# EAGLE design fpga (EAGLE 5.11)
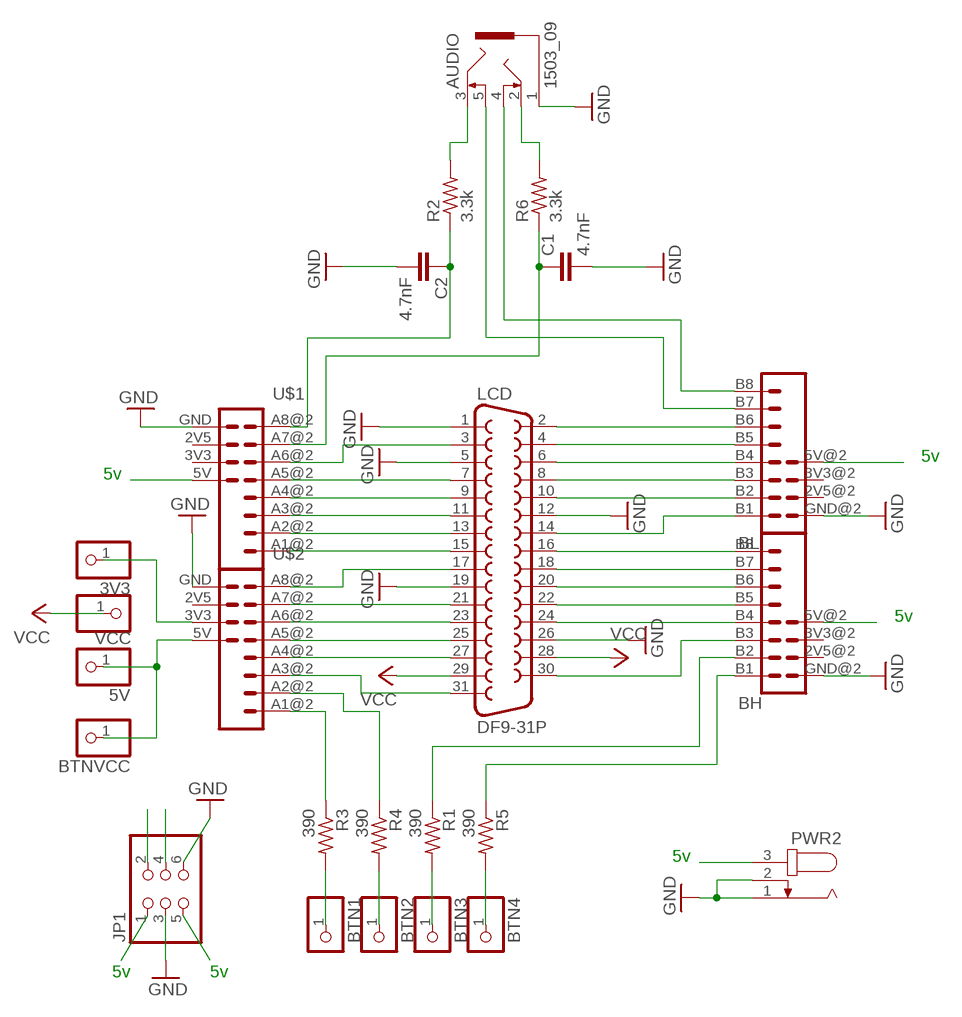
[diagram p0: schematic, sheet 1]

## Parts
3V3  PINHD-1X1  [1X01]
5V  PINHD-1X1  [1X01]
AUDIO  1503_09  [1503_09]
BH  WING_8BIT  [WINGSIDE_8BIT]
BL  WING_8BIT  [WINGSIDE_8BIT]
BTN1  PINHD-1X1  [1X01]
BTN2  PINHD-1X1  [1X01]
BTN3  PINHD-1X1  [1X01]
BTN4  PINHD-1X1  [1X01]
BTNVCC  PINHD-1X1  [1X01]
C1  4.7nF  C-EU025-040X050  [C025-040X050]
C2  4.7nF  C-EU025-040X050  [C025-040X050]
JP1  PINHD-2X3  [2X03]
LCD  DF9-31P  [DF9-31P]
PWR2  JACK-PLUG  [SPC4078-NOSLOT]
R1  390  R-US_0204/7  [0204/7]
R2  3.3k  R-US_0204/7  [0204/7]
R3  390  R-US_0204/7  [0204/7]
R4  390  R-US_0204/7  [0204/7]
R5  390  R-US_0204/7  [0204/7]
R6  3.3k  R-US_0204/7  [0204/7]
U$1  WING_8BIT2  [COCOON_48BIT]
U$2  WING_8BIT2  [COCOON_48BIT]
VCC  PINHD-1X1  [1X01]

## Nets
5V: 5V.1 BH.5V@2(5V) BL.5V@2(5V) BTNVCC.1 JP1.1 JP1.5 PWR2.3 U$1.5V(A4) U$2.5V(A4)
GND: AUDIO.1 BH.GND@2(GND) BL.GND@2(GND) C1.2 C2.2 JP1.3 JP1.6 LCD.1 LCD.5 LCD.12 LCD.19 LCD.26 PWR2.1 PWR2.2 U$1.GND(A1) U$2.GND(A1)
N$1: AUDIO.4 BL.B8
N$2: C1.1 R6.1 U$1.A7@2(A15)
N$3: AUDIO.3 R2.2
N$4: AUDIO.2 R6.2
N$5: AUDIO.5 BL.B7
N$6: BH.B1 R5.1
N$7: LCD.31 U$2.A3@2(A11)
N$8: LCD.27 U$2.A4@2(A12)
N$9: LCD.25 U$2.A5@2(A13)
N$10: LCD.23 U$2.A6@2(A14)
N$11: LCD.21 U$2.A7@2(A15)
N$12: BH.B2 R1.1
N$13: BH.B3 LCD.30
N$14: LCD.17 U$2.A8@2(A16)
N$15: LCD.15 U$1.A1@2(A9)
N$16: LCD.13 U$1.A2@2(A10)
N$17: LCD.11 U$1.A3@2(A11)
N$18: LCD.9 U$1.A4@2(A12)
N$19: BH.B4 LCD.24
N$20: BH.B5 LCD.22
N$21: BH.B6 LCD.20
N$22: BH.B7 LCD.18
N$23: BH.B8 LCD.16
N$24: BL.B1 LCD.14
N$25: BL.B3 LCD.8
N$26: BL.B4 LCD.6
N$27: BL.B2 LCD.10
N$28: BL.B5 LCD.4
N$29: BL.B6 LCD.2
N$30: JP1.4
N$31: JP1.2
N$33: LCD.7 U$1.A5@2(A13)
N$34: R4.1 U$2.A2@2(A10)
N$35: BTN4.1 R5.2
N$36: BTN3.1 R1.2
N$37: BTN1.1 R3.2
N$38: BTN2.1 R4.2
N$39: LCD.3 U$1.A6@2(A14)
N$40: R3.1 U$2.A1@2(A9)
N$41: C2.1 R2.1 U$1.A8@2(A16)
N$42: 3V3.1 U$2.3V3(A3)
VCC: LCD.28 LCD.29 VCC.1
Unconnected: BH.2V5@2(2V5) BH.3V3@2(3V3) BL.2V5@2(2V5) BL.3V3@2(3V3) U$1.2V5(A2) U$1.3V3(A3) U$2.2V5(A2)

## Notes on the sheet
- 5v
- 5v
- 5v
- 5v
- 5v | 5v

## Library data of the parts
3V3 5V BTN1-BTN4 BTNVCC VCC = pinhead:PINHD-1X1: PIN HEADER
AUDIO = con-lumberg:1503_09: Jack connectors according to JISC 6560, 3.5 mm Klinkeneinbaukupplung nach JISC 6560, 3,5 mm, 3-polig/ stereo, abgewinkelte Ausführung, mit 2 Öffnern und Lötaugen, für Leiterplatten Rückseitenmontage Source: http://www.lumberg.com/Produkte/PDFs/1503_09.pdf
BH BL = GadgetFactory_Pub:WING_8BIT
C1 C2 = resistor:C-EU: CAPACITOR, European symbol
JP1 = pinhead:PINHD-2X3: PIN HEADER
LCD = con-hirose:DF9-31P
PWR2 = GadgetFactory:JACK-PLUG: DC POWER JACK Power Jack, DC, Right Angle, Through Hole, Rated 5A at 16VDC, PC Terminals Distributor: Farnell (www.Farnell.de) Drawing: 84N1161.pdf / 84N1162.pdf Manufacturer: SPC Technology (www.spctechnology.com) Type: SPC4077 / SPC 4078
R1-R6 = rcl:R-US_: RESISTOR, American symbol
U$1 U$2 = GadgetFactory_Pub:WING_8BIT2

## Board
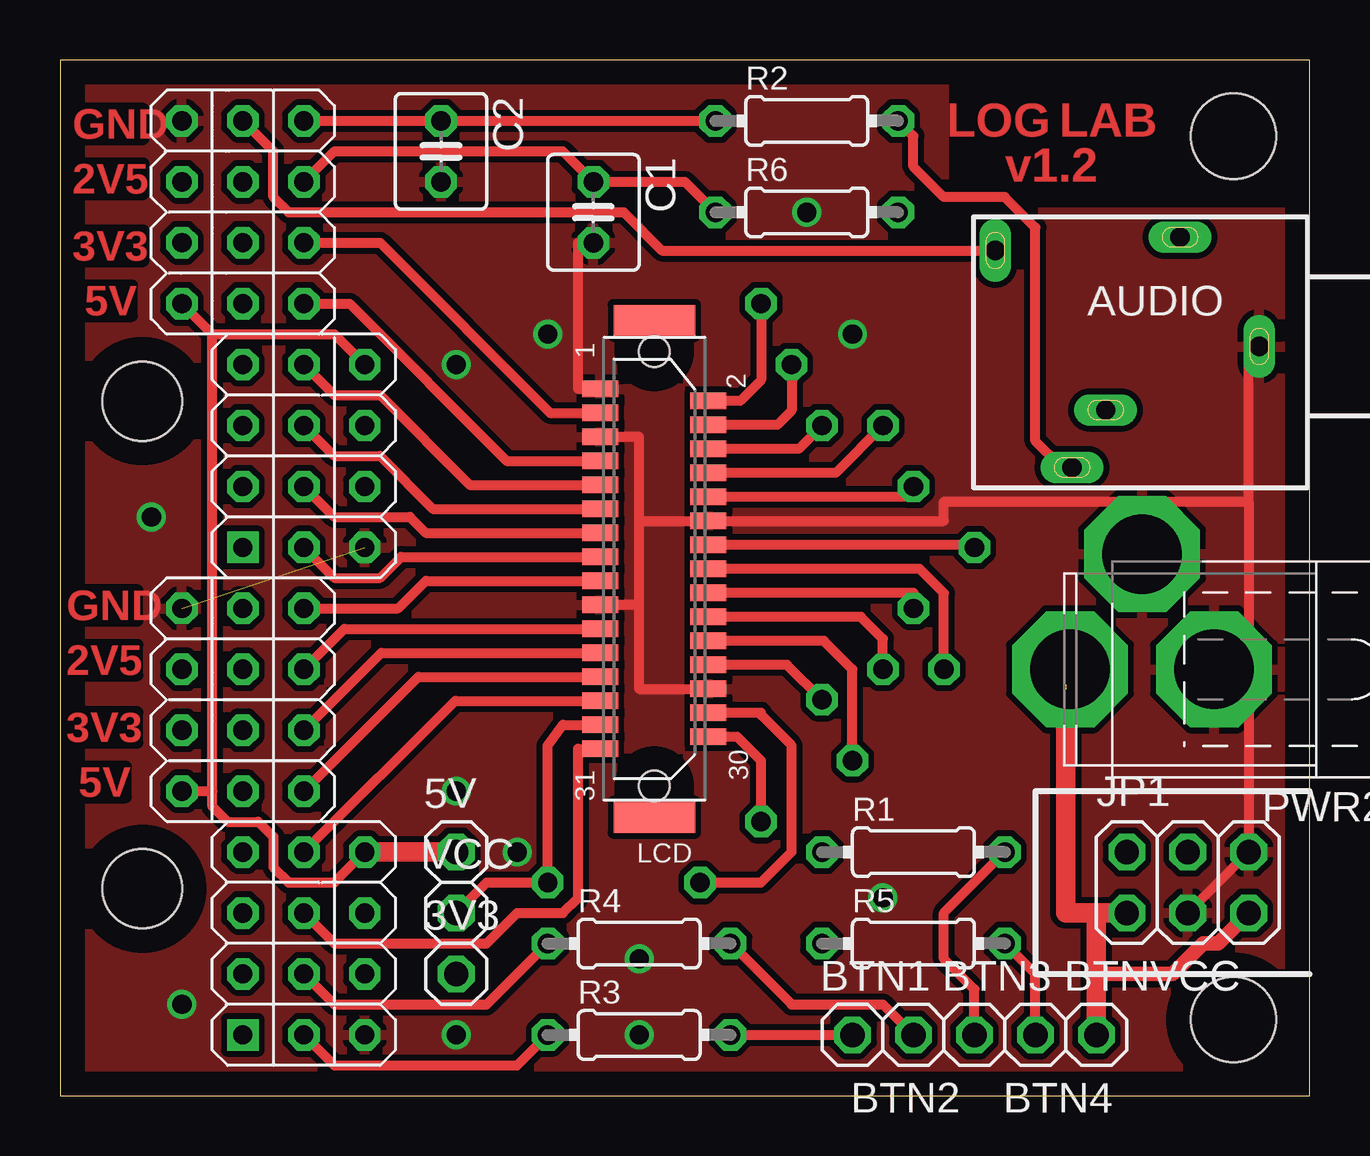
[diagram p1: board, top side]
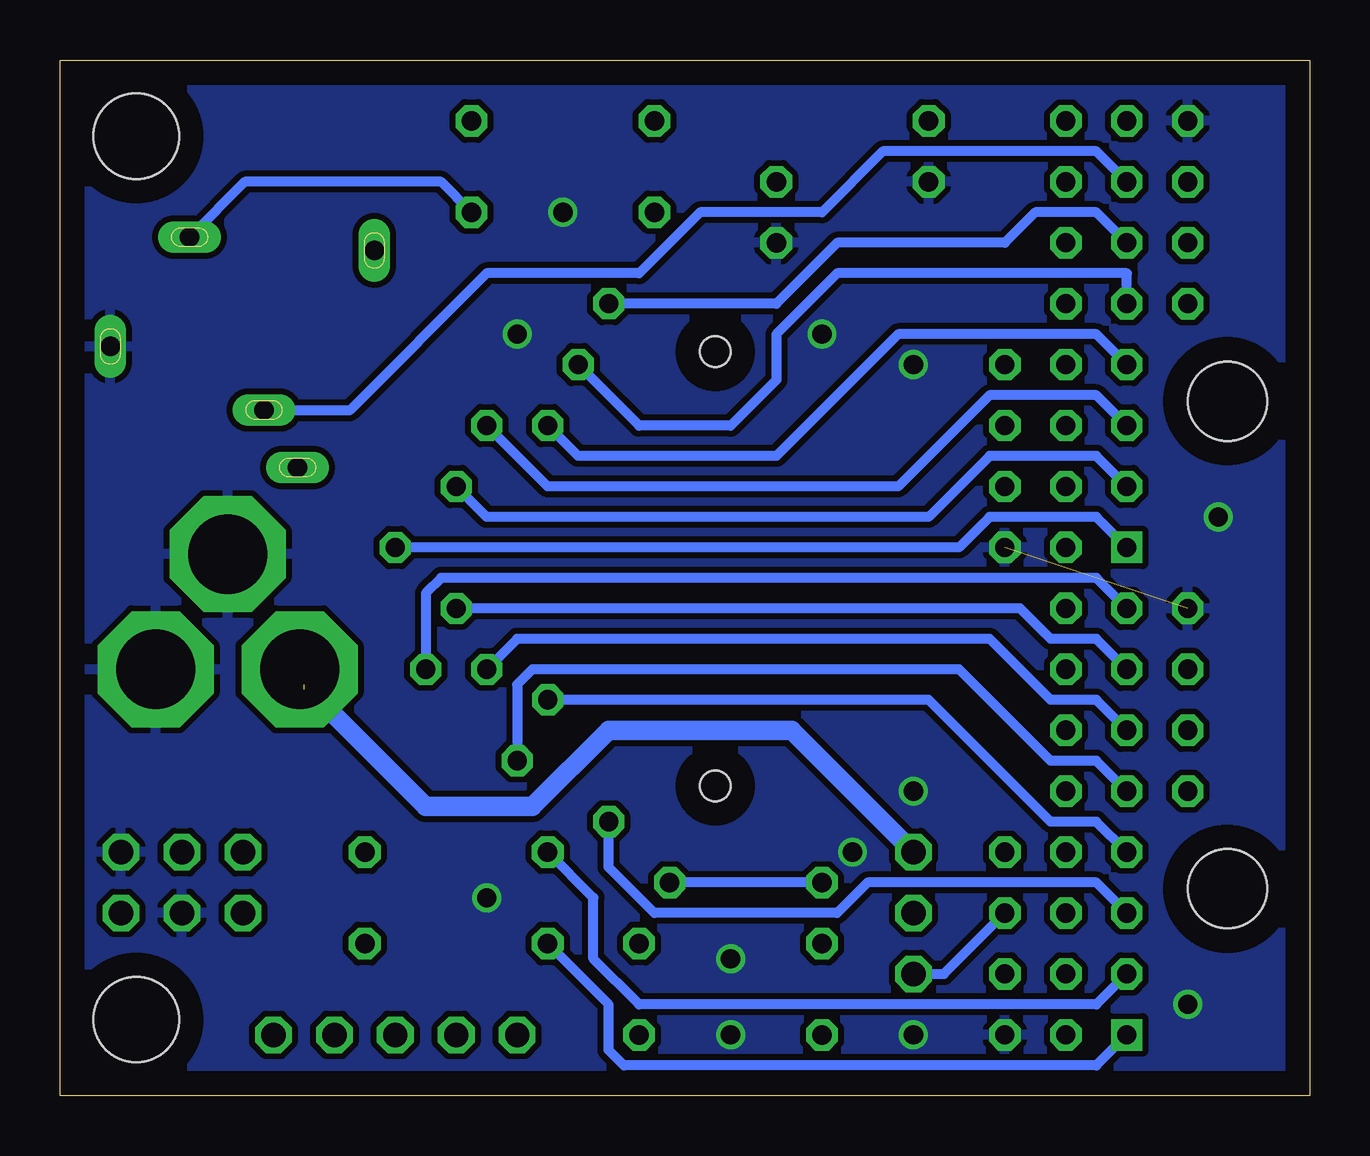
[diagram p2: board, bottom side, seen from below]

Size 52.07 x 43.18 mm. Coordinates in mm from the lower left corner, seen from the top.
Outline: 0,0 52.07,0 52.07,43.18 0,43.17 0,0
Copper layers (1*16): Top 0.035mm / dielectric 1.5mm / Bottom 0.035mm
Design rules "10mils": minimum track width 10mil, minimum drill 24mil, track to track 10mil, track to pad 10mil, pad to pad 10mil, via to via 10mil, smd to smd 10mil, copper to edge 40mil, drill to drill 10mil, minimum pad ring 10mil, minimum via ring 8mil, stop-mask expansion 0mil, vias tented up to drill 0mil, thermal gap 10mil
Holes 3.56 mm at 48.9,3.18 48.9,40.01

### Footprints (pad centres in the part's own frame; a part is rotated, then mirrored left to right if it is on the bottom)
1X01 = drill 1.016 octagon: 1 0,0
1503_09 = drill 0.8 pad 1.2 long: 1 0,-2.1; 2 -4.55,-5.4; 3 5.05,-9.9; 4 -4,-13.1; 5 2.65,-8.5
WINGSIDE_8BIT = drill 0.8 octagon: 2V5@2 16.51,3.81; 3V3@2 13.97,3.81; 5V@2 11.43,3.81; B2 3.81,1.27; B3 6.35,1.27; B4 8.89,1.27; B5 11.43,1.27; B6 13.97,1.27; B7 16.51,1.27; B8 19.05,1.27; GND@2 19.05,3.81 | drill 0.8 square: B1 1.27,1.27 | hole 3.302: 7.366,5.461
C025-040X050 = drill 0.813 octagon: 1 -1.27,0; 2 1.27,0
2X03 = drill 1.016 octagon: 1 -2.54,-1.27; 2 -2.54,1.27; 3 0,-1.27; 4 0,1.27; 5 2.54,-1.27; 6 2.54,1.27
DF9-31P = smd 0.7 x 1.5: 1 7.5,2.25; 2 7,-2.25; 3 6.5,2.25; 4 6,-2.25; 5 5.5,2.25; 6 5,-2.25; 7 4.5,2.25; 8 4,-2.25; 9 3.5,2.25; 10 3,-2.25; 11 2.5,2.25; 12 2,-2.25; 13 1.5,2.25; 14 1,-2.25; 15 0.5,2.25; 16 0,-2.25; 17 -0.5,2.25; 18 -1,-2.25; 19 -1.5,2.25; 20 -2,-2.25; 21 -2.5,2.25; 22 -3,-2.25; 23 -3.5,2.25; 24 -4,-2.25; 25 -4.5,2.25; 26 -5,-2.25; 27 -5.5,2.25; 28 -6,-2.25; 29 -6.5,2.25; 30 -7,-2.25; 31 -7.5,2.25 | smd 1.3 x 3.4: M1 10.35,0; M2 -10.35,0 | hole 1.27: 9.05,0; -9.05,0
SPC4078-NOSLOT = drill 3.302 pad 4.826 octagon: 1 -3,0; 2 0,-4.8; 3 3,0
0204/7 = drill 0.813 octagon: 1 -3.81,0; 2 3.81,0
COCOON_48BIT = drill 0.8 octagon: 2V5 -3.81,16.51; 3V3 -3.81,13.97; 5V -3.81,11.43; A1@2 -1.27,19.05; A2@2 -1.27,16.51; A3@2 -1.27,13.97; A4@2 -1.27,11.43; A5@2 -1.27,8.89; A6@2 -1.27,6.35; A7@2 -1.27,3.81; A8@2 -1.27,1.27; GND -3.81,19.05

### Placement (x,y rotation side)
3V3  16.51,5.08 0 top
5V  16.51,10.16 0 top
AUDIO  52.07,31.24 270 top
BH  8.89,1.27 90 top
BL  8.89,21.59 90 top
BTN1  33.02,2.54 0 top
BTN2  35.56,2.54 0 top
BTN3  38.1,2.54 0 top
BTN4  40.64,2.54 0 top
BTNVCC  43.18,2.54 0 top
C1  22.23,36.83 270 top
C2  15.88,39.37 270 top
JP1  46.99,8.89 0 top
LCD  24.77,21.97 90 top
PWR2  45.09,17.78 180 top
R1  35.56,10.16 0 top
R2  31.11,40.64 0 top
R3  24.13,2.54 0 top
R4  24.13,6.35 0 top
R5  35.56,6.35 0 top
R6  31.11,36.83 0 top
U$1  8.89,41.91 180 top
U$2  8.89,21.59 180 top
VCC  16.51,7.62 0 top

### Tracks (layer width: path | path; a pad name or v marks a point on that pad's centre or on a via)
5V  (1 unrouted)
  Top 0.406: U$2.5V 11.43,8.89 9.53,8.89 8.89,9.53 8.89,10.79 8.26,11.43 6.99,11.43 6.35,12.06 6.35,12.7 | 6.35,12.7 BH.5V@2 | 6.35,12.7 6.35,31.75 | 6.35,31.75 BL.5V@2 | U$1.5V 11.43,31.75 6.35,31.75
  Top 0.61: 43.18,5.08 46.35,5.08 47.62,6.35 48.26,6.35 JP1.5
  Top 0.813: BTNVCC.1 43.18,5.08 43.18,7.62 | 43.18,7.62 JP1.1 | 43.18,7.62 41.91,7.62 41.91,16.94 41.7,16.94 | U$2.5V 5V.1
  Bottom 0.813: 5V.1 21.59,15.24 29.21,15.24 32.38,12.06 36.83,12.06 41.91,17.15 PWR2.3
GND  (via drill 0.8)  (1 unrouted)
  Top 0.406: LCD.26 24.13,16.97 24.13,20.47 | 24.13,20.47 LCD.19 | 24.13,23.97 LCD.12 36.83,23.97 36.83,24.77 45.09,24.77 | 24.13,20.47 24.13,23.97 | 24.13,23.97 24.13,27.47 LCD.5 | LCD.1 21.59,29.47 21.59,35.56 C1.2 | AUDIO.1 49.53,31.24 49.53,24.77 | 45.09,24.77 49.53,24.77 | 49.53,24.77 49.53,17.78 | 49.53,17.78 JP1.6 JP1.3 | 45.09,24.77 PWR2.2 | 49.53,17.78 PWR2.1
  other vias: 3.81,24.13 16.51,2.54 33.02,31.75 24.13,5.71 24.13,2.54 5.08,3.81 16.51,30.48 20.32,31.75 16.51,12.7 31.11,36.83 19.05,10.16 34.29,8.26
  pour Bottom: 0,43.18 52.07,43.18 52.07,0 0,0
  pour Top: 0,43.18 36.83,43.18 36.83,36.83 52.07,36.83 52.07,0 0,0
N$1
  Top 0.406: BL.B8 8.89,39.37 8.89,37.47 9.53,36.83 23.5,36.83 25.08,35.24 AUDIO.4
N$2
  Top 0.406: R6.1 26.04,38.1 C1.1 20.95,39.37 11.43,39.37 U$1.A7@2
N$3
  Top 0.406: AUDIO.3 41.75,26.19 40.64,27.3 40.64,36.2 39.37,37.47 36.83,37.47 35.56,38.73 35.56,40.01 R2.2
N$4
  Bottom 0.406: AUDIO.2 44.36,38.1 36.2,38.1 R6.2
N$5
  Bottom 0.406: BL.B7 8.89,39.37 17.78,39.37 20.32,36.83 25.4,36.83 27.94,34.29 34.29,34.29 40.01,28.58 43.55,28.58 AUDIO.5
N$6
  Bottom 0.406: R5.1 29.21,3.81 29.21,1.91 28.57,1.27 8.89,1.27 BH.B1
N$7
  Top 0.406: LCD.31 21.59,14.47 21.59,8.26 20.95,7.62 19.05,7.62 17.78,6.35 11.43,6.35 U$2.A3@2
N$8
  Top 0.406: LCD.27 16.47,16.47 U$2.A4@2
N$9
  Top 0.406: LCD.25 14.93,17.47 U$2.A5@2
N$10
  Top 0.406: LCD.23 13.39,18.47 U$2.A6@2
N$11
  Top 0.406: LCD.21 11.85,19.47 U$2.A7@2
N$12
  Bottom 0.406: R1.1 29.84,8.26 29.84,5.71 27.94,3.81 8.89,3.81 BH.B2
N$13  (via drill 0.8 pad 1.3)
  Top 0.406: LCD.30 28.21,14.97 29.21,13.97 v29.21,11.43
  Bottom 0.406: v29.21,11.43 29.21,9.53 27.3,7.62 19.68,7.62 18.41,8.89 8.89,8.89 BH.B3
N$14
  Top 0.406: LCD.17 15.24,21.47 14.09,20.32 U$2.A8@2
N$15
  Top 0.406: LCD.15 14.22,22.47 13.34,21.59 11.43,21.59 U$1.A1@2
N$16
  Top 0.406: LCD.13 15.24,23.47 14.58,24.13 11.43,24.13 U$1.A2@2
N$17
  Top 0.406: LCD.11 15.53,24.47 13.34,26.67 11.43,26.67 U$1.A3@2
N$18
  Top 0.406: U$1.A4@2 11.43,29.21 13.34,29.21 17.07,25.47 LCD.9
N$19  (via drill 0.8 pad 1.3)
  Top 0.406: LCD.24 30.29,17.97 v31.75,16.51
  Bottom 0.406: v31.75,16.51 15.88,16.51 10.79,11.43 8.89,11.43 BH.B4
N$20  (via drill 0.8 pad 1.3)
  Top 0.406: LCD.22 31.83,18.97 33.02,17.78 v33.02,13.97
  Bottom 0.406: BH.B5 8.89,13.97 10.79,13.97 14.61,17.78 32.38,17.78 33.02,17.15 v33.02,13.97
N$21  (via drill 0.8 pad 1.3)
  Top 0.406: LCD.20 33.37,19.97 34.29,19.05 v34.29,17.78
  Bottom 0.406: v34.29,17.78 33.02,19.05 13.34,19.05 10.79,16.51 8.89,16.51 BH.B6
N$22  (via drill 0.8 pad 1.3)
  Top 0.406: LCD.18 35.56,20.97 v35.56,20.32
  Bottom 0.406: v35.56,20.32 12.06,20.32 10.79,19.05 8.89,19.05 BH.B7
N$23  (via drill 0.8 pad 1.3)
  Top 0.406: LCD.16 35.81,21.97 36.83,20.95 v36.83,17.78
  Bottom 0.406: BH.B8 8.89,21.59 36.2,21.59 36.83,20.95 v36.83,17.78
N$24  (via drill 0.8 pad 1.3)
  Top 0.406: LCD.14 38.1,22.97 v38.1,22.86
  Bottom 0.406: v38.1,22.86 14.61,22.86 13.34,24.13 8.89,24.13 BL.B1
N$25  (via drill 0.8 pad 1.3)
  Top 0.406: LCD.8 32.32,25.97 v34.29,27.94
  Bottom 0.406: BL.B3 8.89,29.21 13.34,29.21 17.14,25.4 31.75,25.4 32.7,26.35 | 32.7,26.35 32.38,26.03 | 32.7,26.35 v34.29,27.94
N$26  (via drill 0.8 pad 1.3)
  Top 0.406: LCD.6 30.78,26.97 v31.75,27.94
  Bottom 0.406: BL.B4 8.89,31.75 17.14,31.75 22.23,26.67 30.48,26.67 v31.75,27.94
N$27  (via drill 0.8 pad 1.3)
  Top 0.406: LCD.10 35.13,24.97 v35.56,25.4
  Bottom 0.406: BL.B2 8.89,26.67 13.34,26.67 15.88,24.13 34.29,24.13 v35.56,25.4
N$28  (via drill 0.8 pad 1.3)
  Top 0.406: LCD.4 29.88,27.97 30.48,28.58 v30.48,30.48
  Bottom 0.406: BL.B5 7.62,34.29 19.68,34.29 22.23,31.75 22.23,29.84 24.13,27.94 27.94,27.94 v30.48,30.48
N$29  (via drill 0.8 pad 1.3)
  Top 0.406: LCD.2 28.34,28.97 29.21,29.84 v29.21,33.02
  Bottom 0.406: v29.21,33.02 22.23,33.02 19.68,35.56 12.7,35.56 11.43,36.83 8.89,36.83 BL.B6
N$33
  Top 0.406: LCD.7 18.61,26.47 12.06,33.02 U$1.A5@2
N$34
  Top 0.406: U$2.A2@2 11.43,3.81 17.78,3.81 R4.1
N$35
  Top 0.406: BTN4.1 40.64,5.08 R5.2
N$36
  Top 0.406: BTN3.1 38.1,4.45 36.83,5.71 36.83,7.62 R1.2
N$37
  Top 0.406: R3.2 BTN1.1
N$38
  Top 0.406: R4.2 30.48,3.81 34.29,3.81 BTN2.1
N$39
  Top 0.406: LCD.3 20.42,28.47 13.34,35.56 U$1.A6@2
N$40
  Top 0.406: U$2.A1@2 11.43,1.27 19.05,1.27 R3.1
N$41
  Top 0.406: U$1.A8@2 C2.1 R2.1
N$42
  Bottom 0.406: 3V3.1 15.24,5.08 U$2.3V3
VCC  (via drill 0.8 pad 1.3)
  Top 0.406: VCC.1 17.78,8.89 v20.32,8.89 20.32,14.6 20.95,15.47 LCD.29 | LCD.28 29.21,15.97 29.21,15.87 30.48,14.6 30.48,10.16 29.21,8.89 v26.67,8.89
  Bottom 0.406: v20.32,8.89 v26.67,8.89

### Text on the board
Top: LOG | LAB | GND | 2V5 | v1.2 | 3V3 | 5V | GND | 2V5 | 3V3 | 5V